# EAGLE design Control HAT v0.2A (EAGLE 9.3.1)

## Sheet 1 of 2
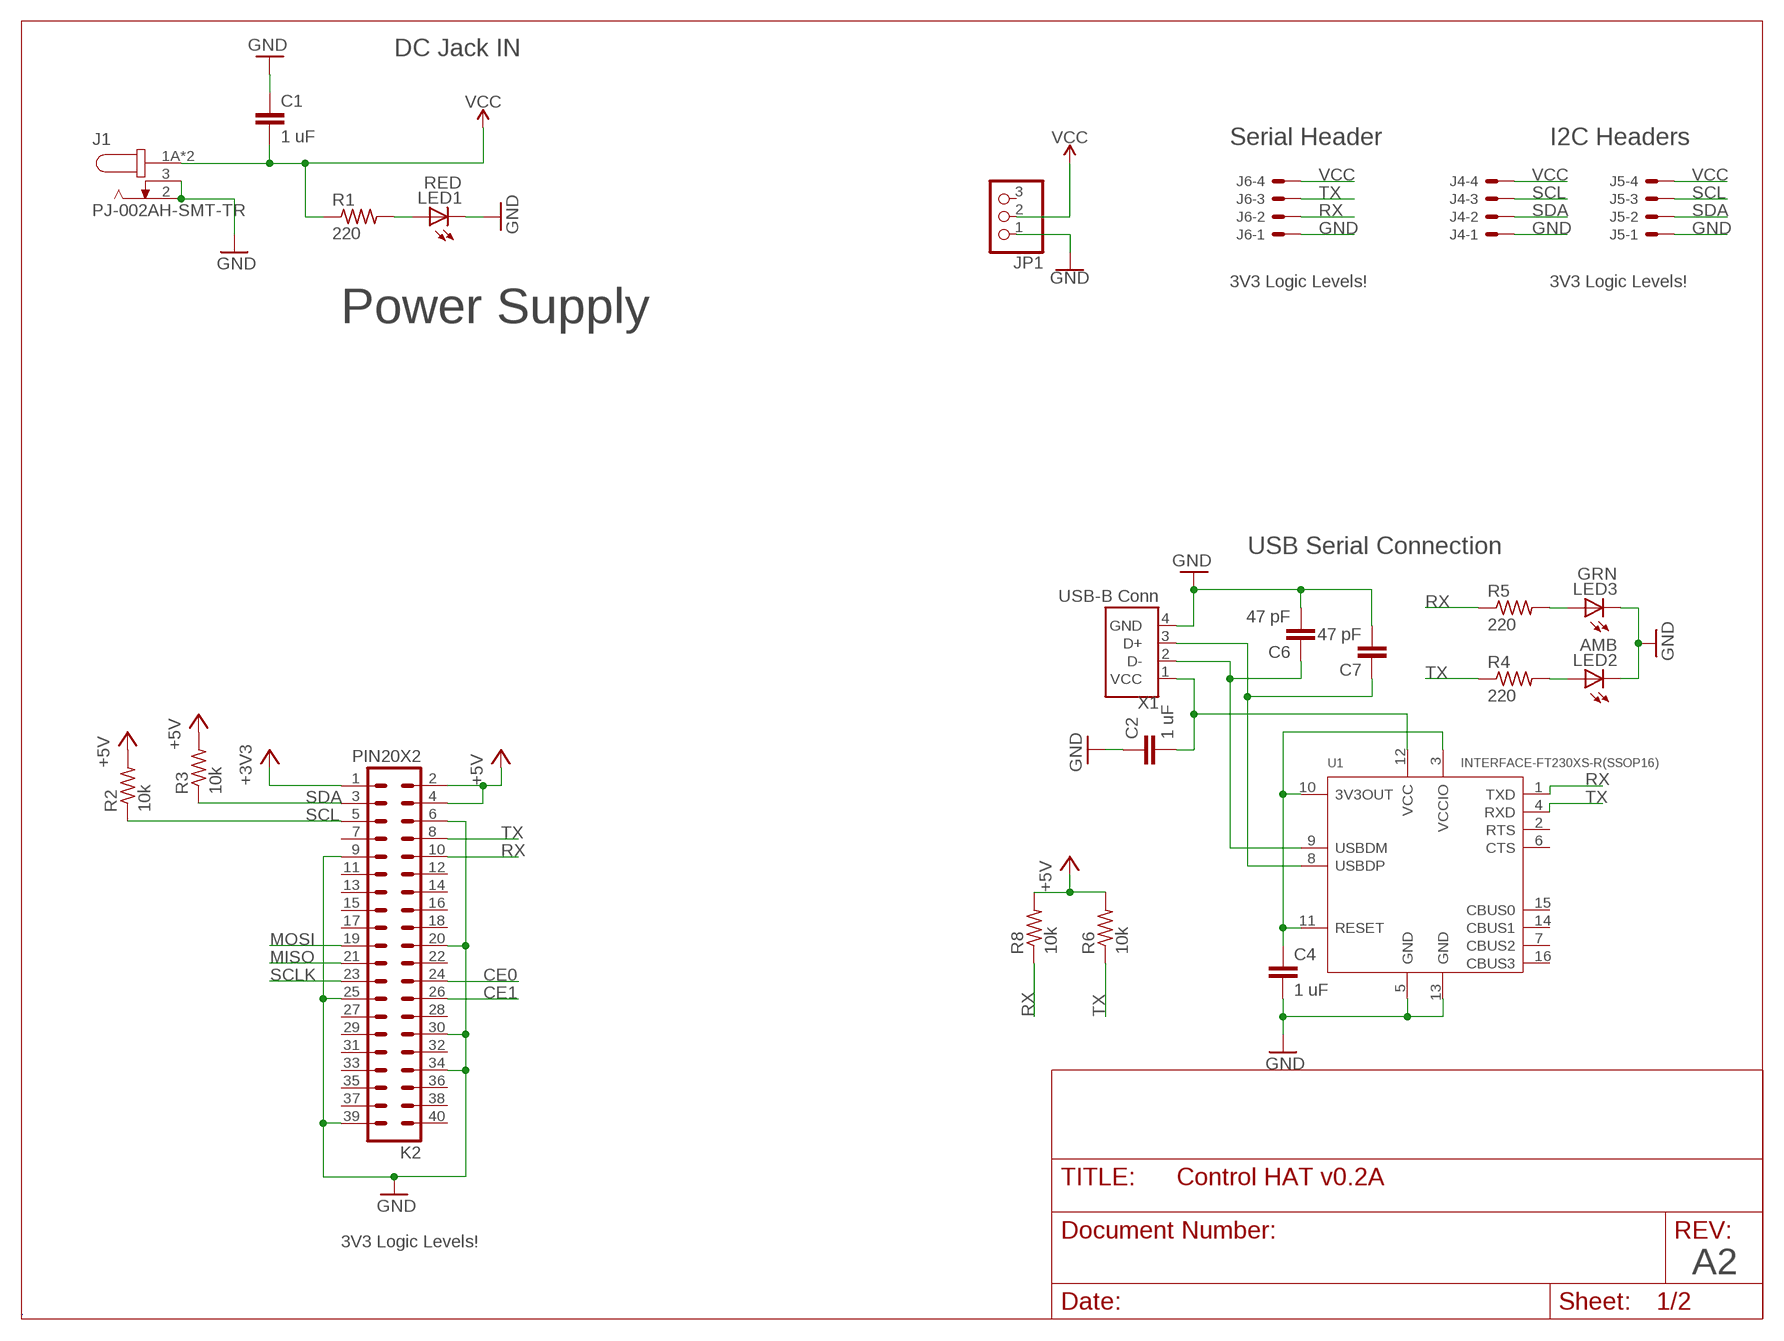
[diagram p0: schematic, sheet 1]
FRAME1 (LETTER_L): SPICEPREFIX: X

### Parts
C1  1 uF  C-EUC0603  [C0603]
C2  1 uF  C-EUC0603  [C0603]
C4  1 uF  C-EUC0603  [C0603]
C6  47 pF  C-EUC0603  [C0603]
C7  47 pF  C-EUC0603  [C0603]
J1  PJ-002AH-SMT-TR  [CUI_PJ-002AH-SMT-TR]
J4  JST-XH-04-PIN-LONG-PAD  [JST-XH-04-PACKAGE-LONG-PAD]
J5  JST-XH-04-PIN-LONG-PAD  [JST-XH-04-PACKAGE-LONG-PAD]
J6  JST-XH-04-PIN-LONG-PAD  [JST-XH-04-PACKAGE-LONG-PAD]
JP1  PINHD-1X3  [1X03]
K2  PIN20X2  [PIN_20X2]
LED1  RED  LEDCHIP-LED0603  [CHIP-LED0603]
LED2  AMB  LEDCHIP-LED0603  [CHIP-LED0603]
LED3  GRN  LEDCHIP-LED0603  [CHIP-LED0603]
R1  220  R-US_M1206  [M1206]
R2  10k  R-US_M1206  [M1206]
R3  10k  R-US_M1206  [M1206]
R4  220  R-US_M1206  [M1206]
R5  220  R-US_M1206  [M1206]
R6  10k  R-US_M1206  [M1206]
R8  10k  R-US_M1206  [M1206]
U1  INTERFACE-FT230XS-R(SSOP16)  [SSOP16-0.635-5X4MM]
X1  USB-B Conn  USB-B1HSB6  [OST_USB-B1HSB6]

### Nets
3V3OUT: C4.1 U1.3(VCCIO) U1.10(3V3OUT) U1.11(RESET)
+3V3: K2.1
+5V: K2.2 K2.4 R2.2 R3.2 R6.2 R8.2
CE0: K2.24
CE1: K2.26
GND: C1.1 C2.1 C4.2 C6.2 C7.2 J1.2 J1.3 J4.1 J5.1 J6.1 JP1.1 K2.6 K2.9 K2.20 K2.25 K2.30 K2.34 K2.39 LED1.C LED2.C LED3.C U1.5(GND) U1.13(GND) X1.4(GND) ; also sheet 2
MISO: K2.21
MOSI: K2.19
N$1: C6.1 U1.9(USBDM) X1.2(D-)
N$2: LED2.A R4.2
N$4: LED1.A R1.2
N$6: C2.2 U1.12(VCC) X1.1(VCC)
N$7: C7.1 U1.8(USBDP) X1.3(D+)
N$8: LED3.A R5.2
RX: J6.2 K2.10 R5.1 R8.1 U1.1(TXD)
SCL: J4.3 J5.3 K2.5 R2.1 ; also sheet 2
SCLK: K2.23
SDA: J4.2 J5.2 K2.3 R3.1 ; also sheet 2
TX: J6.3 K2.8 R4.1 R6.1 U1.4(RXD)
VCC: C1.2 J1.1A J1.1B J4.4 J5.4 J6.4 JP1.2 R1.1 ; also sheet 2
Unconnected: JP1.3 K2.7 K2.11 K2.12 K2.13 K2.14 K2.15 K2.16 K2.17 K2.18 K2.22 K2.27 K2.28 K2.29 K2.31 K2.32 K2.33 K2.35 K2.36 K2.37 K2.38 K2.40 U1.2(RTS) U1.6(CTS) U1.7(CBUS2) U1.14(CBUS1) U1.15(CBUS0) U1.16(CBUS3)

### Notes on the sheet
- DC Jack IN
- Serial Header | I2C Headers
- 3V3 Logic Levels! | 3V3 Logic Levels!
- Power Supply
- USB Serial Connection
- 3V3 Logic Levels!
- A2
- C:/Users/legoh/Documents/Projects/Eagle Projects/Project Argo/References/Pinky and the Brain MC.bmp
- C:/Users/legoh/Documents/Projects/Eagle Projects/Project Argo/References/Pinky and the Brain MC.bmp | C:/Users/legoh/Documents/Projects/Eagle Projects/Project Argo/References/Pinky and the Brain MC.bmp

## Sheet 2 of 2
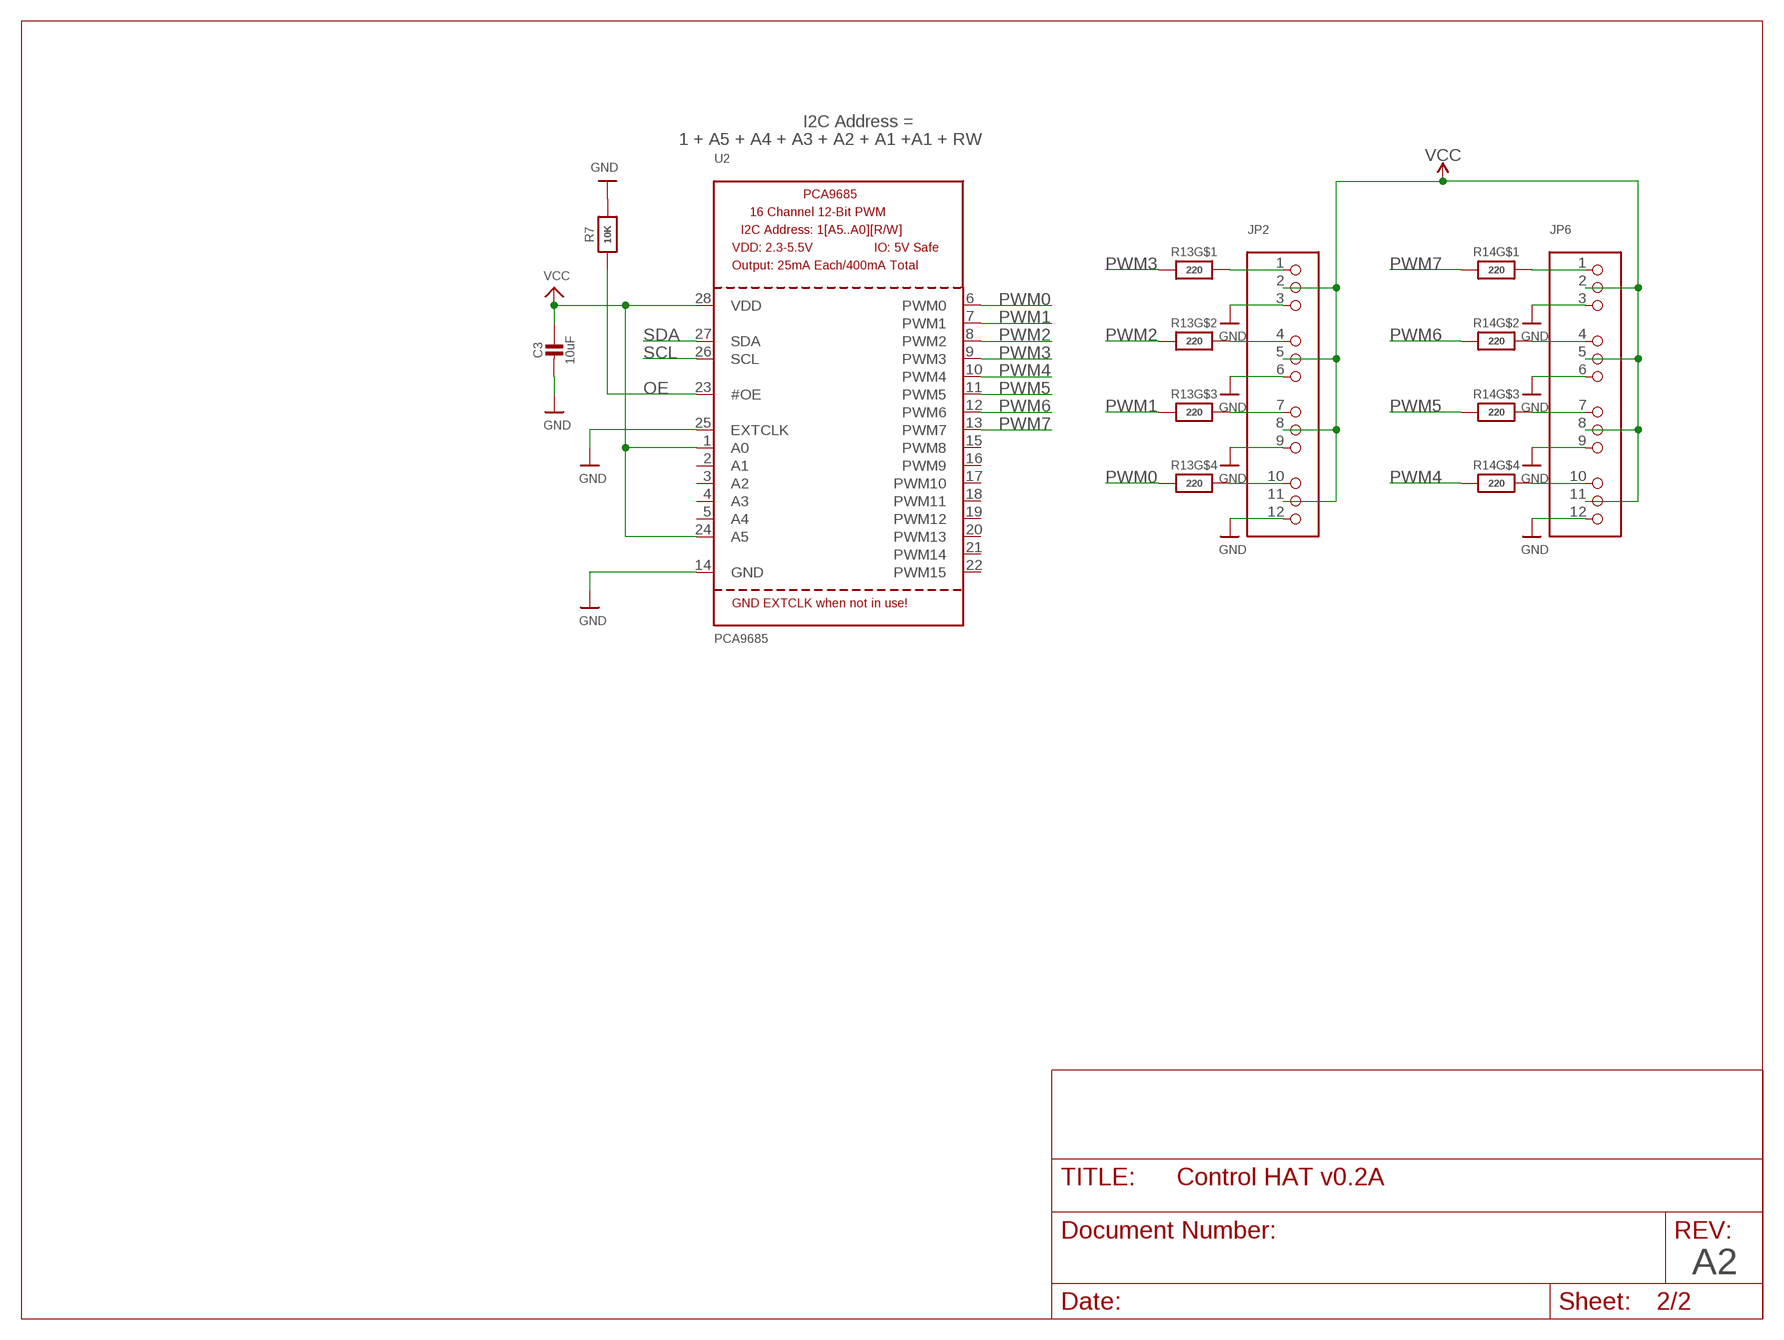
[diagram p1: schematic, sheet 2]

### Parts
C3  10uF  CAP_CERAMIC0805-NOOUTLINE  [0805-NO]
JP2  HEADER-3X04  [3X04]
JP6  HEADER-3X04  [3X04]
R7  10K  RESISTOR0805_NOOUTLINE  [0805-NO]
R13  220  RESISTOR_4PACK  [RESPACK_4X0603]
R14  220  RESISTOR_4PACK  [RESPACK_4X0603]
U2  PCA9685  [TSSOP28]

### Nets
GND: C3.2 JP2.3 JP2.6 JP2.9 JP2.12 JP6.3 JP6.6 JP6.9 JP6.12 R7.2 U2.14(GND) U2.25(EXTCLK) ; also sheet 1
N$3: JP2.1 R13.8
N$5: JP2.4 R13.7
N$9: JP2.7 R13.6
N$10: JP2.10 R13.5
N$11: JP6.10 R14.5
N$12: JP6.7 R14.6
N$13: JP6.4 R14.7
N$14: JP6.1 R14.8
OE: R7.1 U2.23(#OE)
PWM0: R13.4 U2.6(PWM0)
PWM1: R13.3 U2.7(PWM1)
PWM2: R13.2 U2.8(PWM2)
PWM3: R13.1 U2.9(PWM3)
PWM4: R14.4 U2.10(PWM4)
PWM5: R14.3 U2.11(PWM5)
PWM6: R14.2 U2.12(PWM6)
PWM7: R14.1 U2.13(PWM7)
SCL: U2.26(SCL) ; also sheet 1
SDA: U2.27(SDA) ; also sheet 1
VCC: C3.1 JP2.2 JP2.5 JP2.8 JP2.11 JP6.2 JP6.5 JP6.8 JP6.11 U2.1(A0) U2.24(A5) U2.28(VDD) ; also sheet 1
Unconnected: U2.2(A1) U2.3(A2) U2.4(A3) U2.5(A4) U2.15(PWM8) U2.16(PWM9) U2.17(PWM10) U2.18(PWM11) U2.19(PWM12) U2.20(PWM13) U2.21(PWM14) U2.22(PWM15)

### Notes on the sheet
- I2C Address =
- 1 + A5 + A4 + A3 + A2 + A1 +A1 + RW
- A2

## Library data of the parts
C1 C2 C4 C6 C7 = rcl:C-EU: CAPACITOR, European symbol; SPICEPREFIX: C
C3 = microbuilder:CAP_CERAMIC: Ceramic Capacitors For new designs, use the packages preceded by an '_' character since they are more reliable: The following footprints should be used on most boards: _0402 - Standard footprint for regular board layouts _0603 - Standard footprint for regular board layouts _0805 - Standard footprint for regular board layouts _1206 - Standard footprint for regular board layouts For extremely tight-pitch boards where space is at a premium, the following 'micro-pitch' footprints can be used (smaller pads, no silkscreen outline, etc.): _0402MP - Micro-pitch footprint for very dense/compact boards _0603MP - Micro-pitch footprint for very dense/compact boards _0805MP - Micro-pitch footprint for very dense/compact boards _1206MP - Micro-pitch footprint for very dense/compact boards
J1 = PJ-002AH-SMT-TR:PJ-002AH-SMT-TR: 2.0 mm Center Pin, 5.0 A, Right Angle, Surface Mount (SMT), Dc Power Jack Connector; CUI_PURCHASE_URL: https://www.cui.com/product/interconnect/dc-power-connectors/jacks/2.0-mm-center-pin/pj-002ah-smt-tr?utm_source=snapeda.com&utm_medium=referral&utm_campaign=snapedaBOM; DESCRIPTION: 24 VDC 5 A Surface Mount Unshielded 2 Conductors 3 Contacts Male Power Jack; DIGI-KEY_PART_NUMBER: CP-002AHPJCT-ND; DIGI-KEY_PURCHASE_URL: https://www.digikey.com/product-detail/en/cui-inc/PJ-002AH-SMT-TR/CP-002AHPJCT-ND/669692?utm_source=snapeda&utm_medium=aggregator&utm_campaign=symbol; MF: CUI Inc.; MP: PJ-002AH-SMT-TR; PACKAGE: None
J4-J6 = JST XH Connectors v1-0:JST-XH-04-PIN: JST XH Connector 2 Pin Wire to board connector. Pitch: 2,54 mm, (0.100") Number of pins: 4 Created by Rembrandt Electronics www.rembrandtelectronics.com
JP1 = pinhead:PINHD-1X3: PIN HEADER
JP2 JP6 = microbuilder:HEADER-3X04
K2 = FLYFISH:PIN20X2
LED1-LED3 = led:LED: LED OSRAM: - CHIPLED LG R971, LG N971, LY N971, LG Q971, LY Q971, LO R971, LY R971 LH N974, LH R974 LS Q976, LO Q976, LY Q976 LO Q996 - Hyper CHIPLED LW Q18S LB Q993, LB Q99A, LB R99A - SideLED LS A670, LO A670, LY A670, LG A670, LP A670 LB A673, LV A673, LT A673, LW A673 LH A674 LY A675 LS A676, LA A676, LO A676, LY A676, LW A676 LS A679, LY A679, LG A679 - Hyper Micro SIDELED® LS Y876, LA Y876, LO Y876, LY Y876 LT Y87S - SmartLED LW L88C, LW L88S LB L89C, LB L89S, LG L890 LS L89K, LO L89K, LY L89K LS L896, LA L896, LO L896, LY L896 - TOPLED LS T670, LO T670, LY T670, LG T670, LP T670 LSG T670, LSP T670, LSY T670, LOP T670, LYG T670 LG T671, LOG T671, LSG T671 LB T673, LV T673, LT T673, LW T673 LH T674 LS T676, LA T676, LO T676, LY T676, LB T676, LH T676, LSB T676, LW T676 LB T67C, LV T67C, LT T67C, LS T67K, LO T67K, LY T67K, LW E67C LS E67B, LA E67B, LO E67B, LY E67B, LB E67C, LV E67C, LT E67C LW T67C LS T679, LY T679, LG T679 LS T770, LO T770, LY T770, LG T770, LP T770 LB T773, LV T773, LT T773, LW T773 LH T774 LS E675, LA E675, LY E675, LS T675 LS T776, LA T776, LO T776, LY T776, LB T776 LHGB T686 LT T68C, LB T68C - Hyper Mini TOPLED® LB M676 - Mini TOPLED Santana® LG M470 LS M47K, LO M47K, LY M47K Source: http://www.osram.convergy.de LUXEON: - LUMILED® LXK2-PW12-R00, LXK2-PW12-S00, LXK2-PW14-U00, LXK2-PW14-V00 LXK2-PM12-R00, LXK2-PM12-S00, LXK2-PM14-U00 LXK2-PE12-Q00, LXK2-PE12-R00, LXK2-PE12-S00, LXK2-PE14-T00, LXK2-PE14-U00 LXK2-PB12-K00, LXK2-PB12-L00, LXK2-PB12-M00, LXK2-PB14-N00, LXK2-PB14-P00, LXK2-PB14-Q00 LXK2-PR12-L00, LXK2-PR12-M00, LXK2-PR14-Q00, LXK2-PR14-R00 LXK2-PD12-Q00, LXK2-PD12-R00, LXK2-PD12-S00 LXK2-PH12-R00, LXK2-PH12-S00 LXK2-PL12-P00, LXK2-PL12-Q00, LXK2-PL12-R00 Source: www.luxeon.com KINGBRIGHT: KA-3528ASYC Source: www.kingbright.com
R1-R6 R8 = resistor:R-US_: RESISTOR, American symbol
R7 = microbuilder:RESISTOR: Resistors For new designs, use the packages preceded by an '_' character since they are more reliable: The following footprints should be used on most boards: _0402 - Standard footprint for regular board layouts _0603 - Standard footprint for regular board layouts _0805 - Standard footprint for regular board layouts _1206 - Standard footprint for regular board layouts For extremely tight-pitch boards where space is at a premium, the following 'micro-pitch' footprints can be used (smaller pads, no silkscreen outline, etc.): _0402MP - Micro-pitch footprint for very dense/compact boards _0603MP - Micro-pitch footprint for very dense/compact boards _0805MP - Micro-pitch footprint for very dense/compact boards _1206MP - Micro-pitch footprint for very dense/compact boards
R13 R14 = microbuilder:RESISTOR_4PACK: Resistor Packs (4 resistors) 4 x 0603 10K 1/16W - Digikey: YC164J-10KCT-ND
U1 = FT230XS:INTERFACE-FT230XS-R(SSOP16): 310070030; AVAILABILITY: Unavailable; DESCRIPTION: USB Full Speed to Basic UART IC with USB Charger Detection; MF: FTDI,; MP: FT230XS-R; PACKAGE: SSOP-16 FTDI; PRICE: None
U2 = microbuilder:PCA9685: PCA9685 - 16 Channel 12-Bit I2C PWM Controller 5.0V tolerant 16 channel, 12-bit I2C PWM controller with 25mA per output (max. 400mA total) Digikey: 568-5931-1-ND
X1 = USB-B Connector:USB-B1HSB6: Conn Usb Type b r/a Black; AVAILABILITY: Unavailable; DESCRIPTION: Conn Usb Type b r/a Black; MF: On Shore; MP: USB-B1HSB6; PACKAGE: None; PRICE: None

## Board
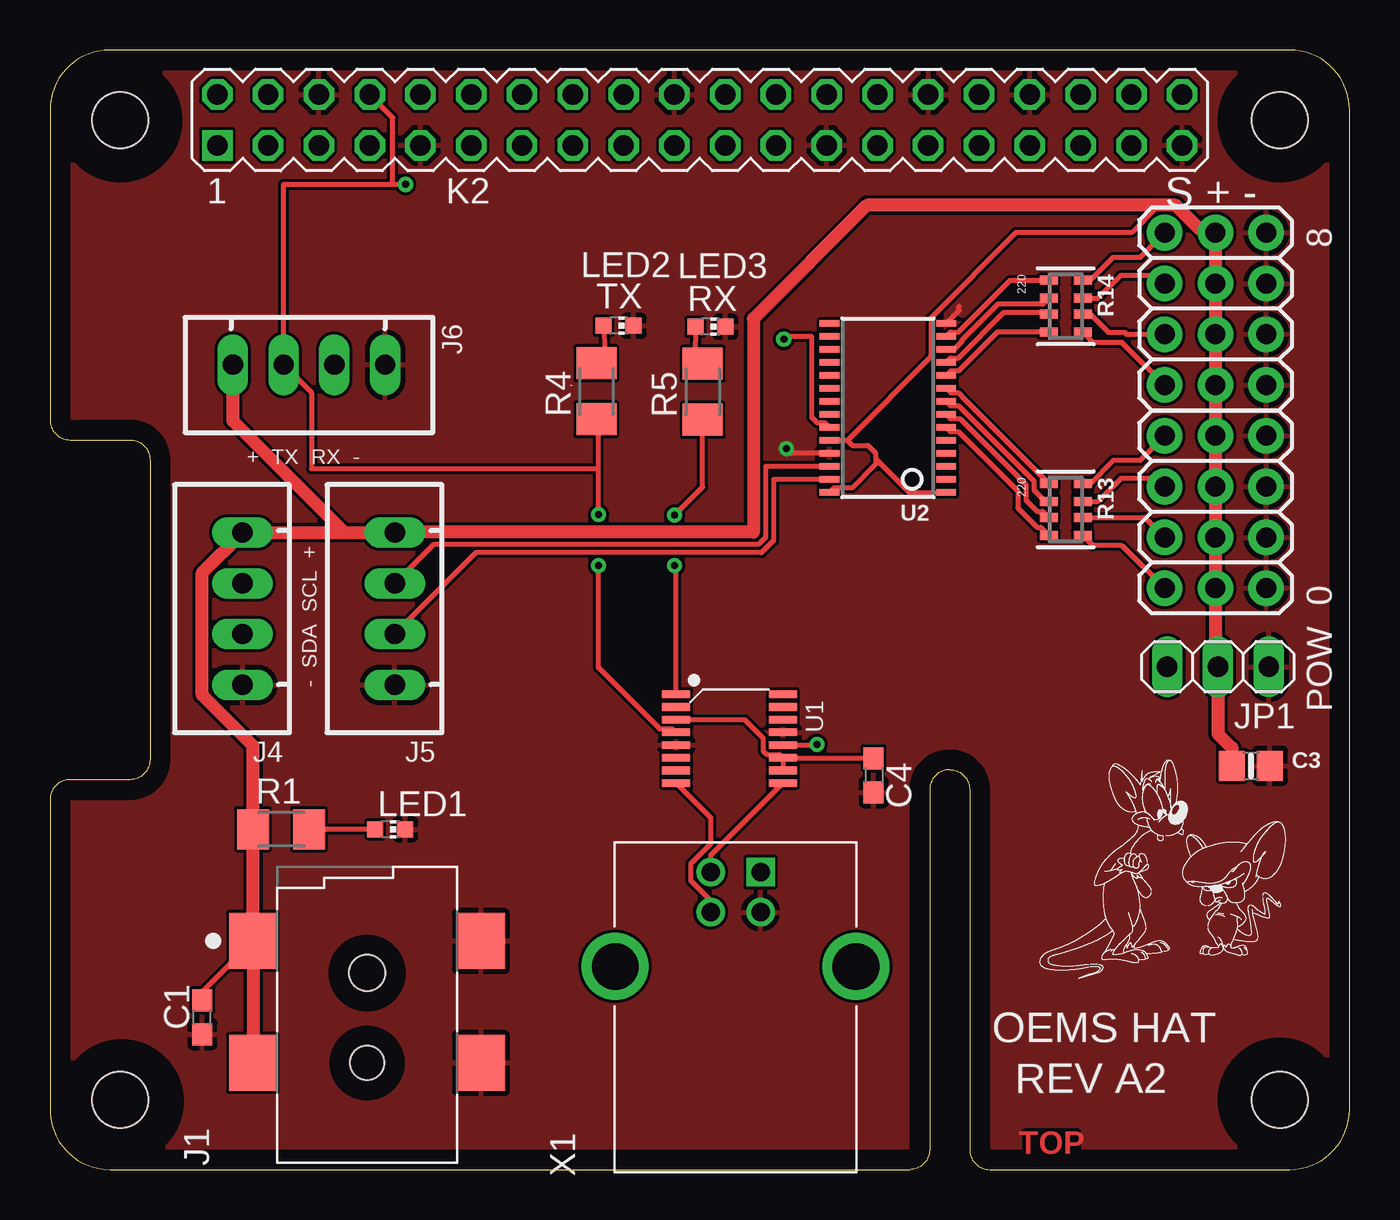
[diagram p2: board, top side]
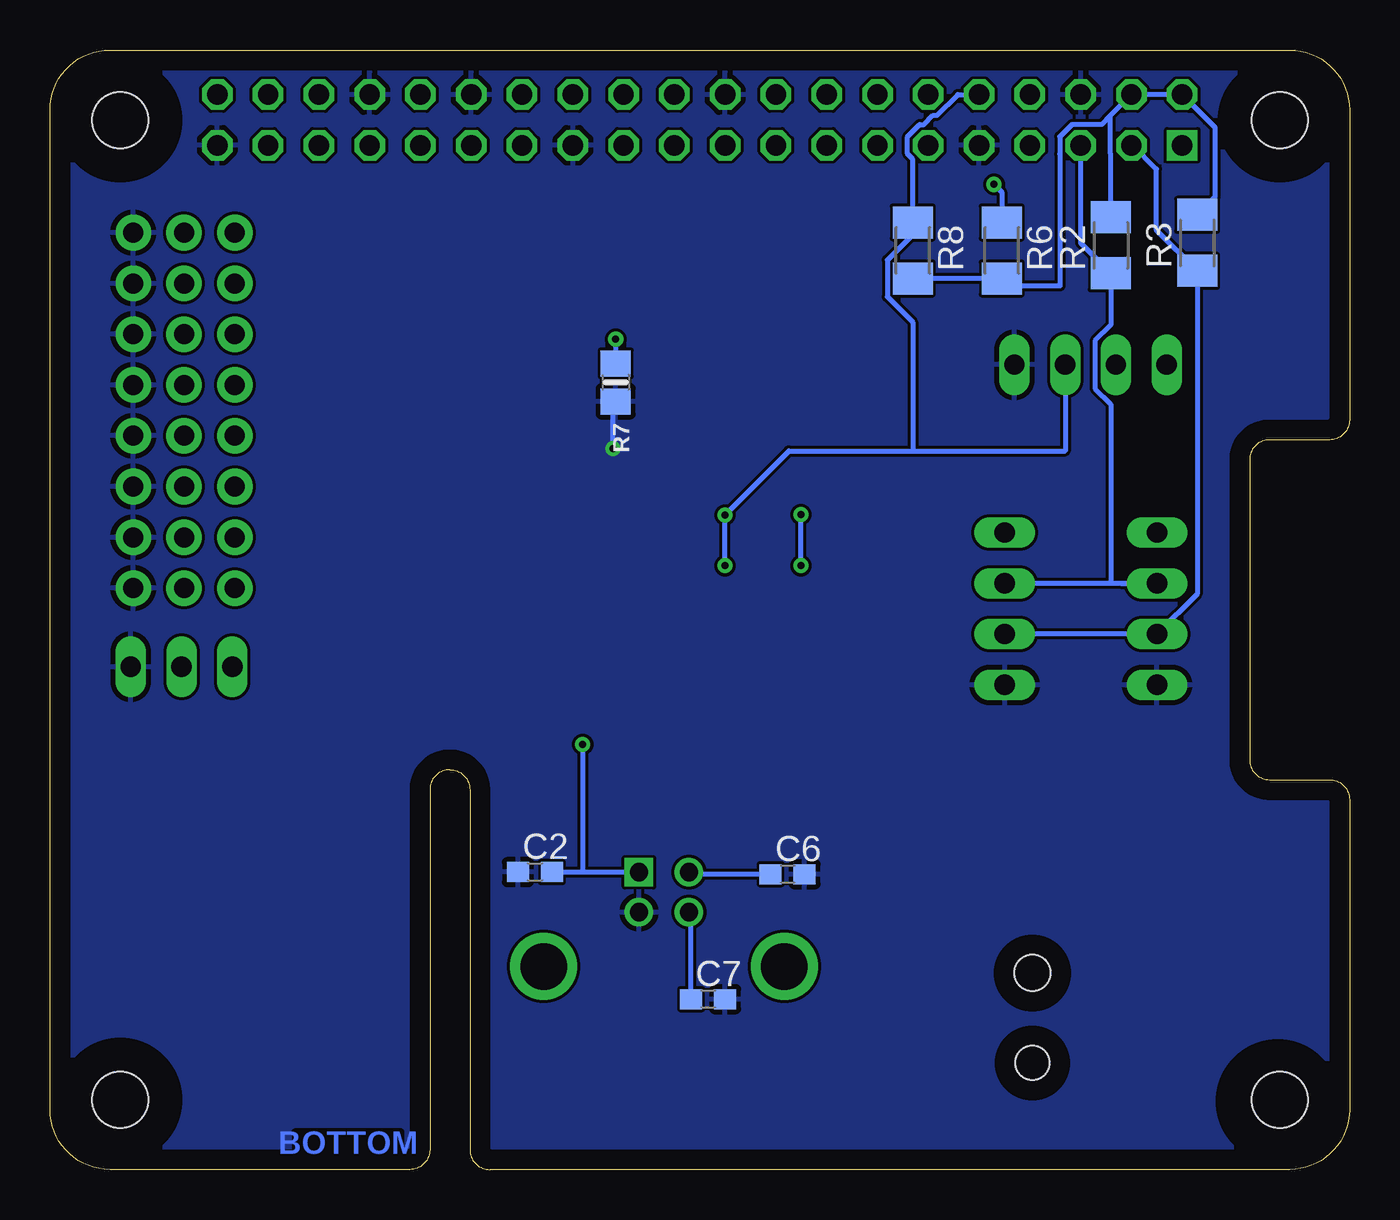
[diagram p3: board, bottom side, seen from below]

Size 65 x 56 mm. Coordinates in mm from the lower left corner, seen from the top.
Outline: 0,3 arc90 3,0 43,0 arc90 44,1 44,19 arc-90 45,20 arc-90 46,19 46,1 arc90 47,0 62,0 arc90 65,3 65,53 arc90 62,56 3,56 arc90 0,53 0,37.5 arc90 1,36.5 4,36.5 arc-90 5,35.5 5,20.5 arc-90 4,19.5 1,19.5 arc90 0,18.5 0,3
Copper layers (1*16): Top 0.035mm / dielectric 1.5mm / Bottom 0.035mm
Design rules "default": minimum track width 6mil, minimum drill 0.35mm, track to track 6mil, track to pad 6mil, pad to pad 6mil, via to via 6mil, smd to smd 6mil, copper to edge 40mil, drill to drill 6mil, minimum pad ring 10mil, minimum via ring 8mil, stop-mask expansion 4mil, vias tented up to drill 0mil, thermal gap 10mil
Holes 2.8 mm at 3.5,3.5 3.5,52.5 61.5,52.5 61.5,3.5
tRestrict: area 1.9,51 to 5,54; area 60,51 to 63,54; area 60,1.9 to 63,5; area 2,1.9 to 5.1,5
bRestrict: area 1.9,51 to 5,54; area 60,1.9 to 63,5; area 60,51 to 63,54; area 2,1.9 to 5.1,5

### Footprints (pad centres in the part's own frame; a part is rotated, then mirrored left to right if it is on the bottom)
C0603 = smd 1.1 x 1: 1 -0.85,0; 2 0.85,0
0805-NO = smd 1.3 x 1.5: 1 -0.95,0; 2 0.95,0
CUI_PJ-002AH-SMT-TR = smd 2.8 x 2.4: 1A 0,0; 1B -6.1,0; 2 -6.1,-11.4; 3 0,-11.4 | hole 1.7: -6.1,-5.7 | hole 1.8: -1.6,-5.7
JST-XH-04-PACKAGE-LONG-PAD = drill 1.016 long: 1 -3.81,0; 2 -1.27,0; 3 1.27,0; 4 3.81,0
1X03 = drill 1.016 long: 1 -2.54,0; 2 0,0; 3 2.54,0
3X04 = drill 1 pad 1.778: 1 -3.81,-2.54; 2 -3.81,0; 3 -3.81,2.54; 4 -1.27,-2.54; 5 -1.27,0; 6 -1.27,2.54; 7 1.27,-2.54; 8 1.27,0; 9 1.27,2.54; 10 3.81,-2.54; 11 3.81,0; 12 3.81,2.54
PIN_20X2 = drill 1.016 square: 1 -24.13,-1.27 | drill 1.016 octagon: 2 -24.13,1.27; 3 -21.59,-1.27; 4 -21.59,1.27; 5 -19.05,-1.27; 6 -19.05,1.27; 7 -16.51,-1.27; 8 -16.51,1.27; 9 -13.97,-1.27; 10 -13.97,1.27; 11 -11.43,-1.27; 12 -11.43,1.27; 13 -8.89,-1.27; 14 -8.89,1.27; 15 -6.35,-1.27; 16 -6.35,1.27; 17 -3.81,-1.27; 18 -3.81,1.27; 19 -1.27,-1.27; 20 -1.27,1.27; 21 1.27,-1.27; 22 1.27,1.27; 23 3.81,-1.27; 24 3.81,1.27; 25 6.35,-1.27; 26 6.35,1.27; 27 8.89,-1.27; 28 8.89,1.27; 29 11.43,-1.27; 30 11.43,1.27; 31 13.97,-1.27; 32 13.97,1.27; 33 16.51,-1.27; 34 16.51,1.27; 35 19.05,-1.27; 36 19.05,1.27; 37 21.59,-1.27; 38 21.59,1.27; 39 24.13,-1.27; 40 24.13,1.27
CHIP-LED0603 = smd 0.8 x 0.8: A 0,-0.75; C 0,0.75
M1206 = smd 1.6 x 2: 1 -1.4,0; 2 1.4,0
RESPACK_4X0603 = smd 0.45 x 0.9: 1 -1.3,-0.85; 2 -0.4,-0.85; 3 0.4,-0.85; 4 1.3,-0.85; 5 1.3,0.85; 6 0.4,0.85; 7 -0.4,0.85; 8 -1.3,0.85
SSOP16-0.635-5X4MM = smd 0.381 x 1.397: 1 -2.223,-2.667; 2 -1.587,-2.667; 3 -0.953,-2.667; 4 -0.318,-2.667; 5 0.318,-2.667; 6 0.953,-2.667; 7 1.587,-2.667; 8 2.223,-2.667; 9 2.223,2.667; 10 1.587,2.667; 11 0.953,2.667; 12 0.318,2.667; 13 -0.318,2.667; 14 -0.953,2.667; 15 -1.587,2.667; 16 -2.223,2.667
TSSOP28 = smd 0.305 x 0.991: 1 -4.225,-2.918; 2 -3.575,-2.918; 3 -2.925,-2.918; 4 -2.275,-2.918; 5 -1.625,-2.918; 6 -0.975,-2.918; 7 -0.325,-2.918; 8 0.325,-2.918; 9 0.975,-2.918; 10 1.625,-2.918; 11 2.275,-2.918; 12 2.925,-2.918; 13 3.575,-2.918; 14 4.225,-2.918; 15 4.225,2.918; 16 3.575,2.918; 17 2.925,2.918; 18 2.275,2.918; 19 1.625,2.918; 20 0.975,2.918; 21 0.325,2.918; 22 -0.325,2.918; 23 -0.975,2.918; 24 -1.625,2.918; 25 -2.275,2.918; 26 -2.925,2.918; 27 -3.575,2.918; 28 -4.225,2.918
OST_USB-B1HSB6 = drill 0.92 square: 1 1.25,4.71 | drill 0.92: 2 -1.25,4.71; 3 -1.25,2.71; 4 1.25,2.71 | drill 2.33: P1 -6.02,0; P2 6.02,0

### Placement (x,y rotation side)
C1  7.62,7.62 90 top
C2  40.74,14.88 0 bottom
C3  60.07,20.19 0 top
C4  41.2,19.72 270 top
C6  28.11,14.77 0 bottom
C7  32.08,8.52 0 bottom
J1  10.16,11.43 90 top
J4  9.63,28.05 90 top
J5  17.25,28.05 90 top
J6  12.95,40.26 180 top
JP1  58.42,25.15 180 top
JP2  58.29,32.89 270 top
JP6  58.29,43.05 270 top
K2  32.5,52.5 0 top
LED1  17.02,17.02 270 top
LED2  28.45,42.2 270 top
LED3  33.03,42.15 270 top
R1  11.56,17.02 0 top
R2  11.94,46.23 90 bottom
R3  7.62,46.35 90 bottom
R4  27.33,38.93 90 top
R5  32.64,38.9 90 top
R6  17.4,45.97 270 bottom
R7  36.7,39.37 270 bottom
R8  21.84,45.97 270 bottom
R13  50.8,33.02 270 top
R14  50.8,43.18 270 top
U1  33.99,21.55 270 top
U2  41.91,38.1 90 top
X1  34.29,10.16 0 top

### Tracks (layer width: path | path; a pad name or v marks a point on that pad's centre or on a via)
3V3OUT
  Top 0.254: U1.11 U1.10 | U1.11 41.17,20.6 C4.1 | U1.3 34.75,22.5 35.67,21.58 35.67,20.93 35.84,20.77 36.49,20.77 U1.11
+5V
  Bottom 0.254: 12.06,47.5 R2.2 | R3.2 6.73,48.65 6.73,52.13 K2.2 K2.4 11.95,52.73 | 11.81,47.76 R2.2 | R2.2 11.94,50.79 11.95,50.8 11.95,52.73 | 11.95,52.73 12.41,52.27 13.88,52.27 14.49,51.66 14.49,50.8 14.48,50.79 14.48,44.2 17.02,44.2 R6.2 R8.2
GND  (via drill 0.35)
  Top 0.254: U2.14 45.47,42.96 45.47,43.18 | U2.25 37.07,35.83 v36.83,36.07
  Bottom 0.254: v36.83,36.07 36.83,38.29 R7.2
  pour Bottom: 0,3 arc90 3,0 43,0 arc90 44,1 44,19 arc-90 45,20 arc-90 46,19 46,1 arc90 47,0 62,0 arc90 65,3 65,53 arc90 62,56 3,56 arc90 0,53 0,37.5 arc90 1,36.5 4,36.5 arc-90 5,35.5 5,20.5 arc-90 4,19.5 1,19.5 arc90 0,18.5
  pour Top: 0,3 arc90 3,0 43,0 arc90 44,1 44,19 arc-90 45,20 arc-90 46,19 46,1 arc90 47,0 62,0 arc90 64.75,2.75 64.75,53.25 arc90 62,56 3,56 arc90 0,53 0,37.5 arc90 1,36.5 4,36.5 arc-90 5,35.5 5,20.5 arc-90 4,19.5 1,19.5 arc90 0,18.5
N$1
  Top 0.254: U1.9 33.04,15.72 X1.2
  Bottom 0.254: C6.1 32.94,14.77 X1.2
N$2
  Top 0.254: LED2.A 27.76,40.83 R4.2
N$3
  Top 0.254: R13.8 52.03,34.32 53.17,35.46 54.51,35.46 JP2.1
N$4
  Top 0.254: LED1.A R1.2
N$5
  Top 0.254: R13.7 52.41,33.42 53.55,34.56 55.35,34.56 JP2.4
N$6  (via drill 0.35)
  Top 0.254: U1.12 38.33,21.23 v38.35,21.26
  Bottom 0.254: X1.1 38.35,14.87 | 38.35,14.87 39.88,14.87 C2.2 | v38.35,21.26 38.35,14.87
N$7
  Top 0.254: U1.8 33.04,17.61 33.04,16.29 32.05,15.3 32.05,14.46 33.04,13.46 X1.3
  Bottom 0.254: C7.1 32.93,12.76 X1.3
N$8
  Top 0.254: LED3.A 32.26,40.67 R5.2
N$9
  Top 0.254: R13.6 54.76,32.62 JP2.7
N$10
  Top 0.254: R13.5 52.16,31.21 53.62,31.21 JP2.10
N$11
  Top 0.254: R14.5 52.16,41.37 53.62,41.37 JP6.10
N$12
  Top 0.254: R14.6 52.03,42.78 52.94,41.88 53.74,41.88 53.83,41.78 JP6.7
N$13
  Top 0.254: R14.7 52.41,43.58 53.55,44.72 55.35,44.72 JP6.4
N$14
  Top 0.254: R14.8 52.03,44.48 53.17,45.62 54.51,45.62 JP6.1
OE  (via drill 0.35)
  Top 0.254: U2.23 38.77,37.34 38.38,37.34 38.1,37.62 38.1,41.66 36.83,41.66 v36.7,41.53
  Bottom 0.254: v36.7,41.53 R7.1
PWM0
  Top 0.254: U2.6 45.05,36.91 45.44,36.91 48.41,33.94 48.41,33.09 49.38,32.12 49.55,32.12 R13.4
PWM1
  Top 0.254: U2.7 45.05,37.56 45.51,37.56 48.81,34.26 48.81,33.49 49.38,32.92 49.65,32.92 R13.3
PWM2
  Top 0.254: U2.8 45.05,38.21 45.44,38.21 49.22,34.42 49.22,33.98 49.78,33.42 R13.2
PWM3
  Top 0.254: U2.9 45.05,38.86 45.44,38.86 45.6,38.69 45.6,38.67 R13.1
PWM4
  Top 0.254: U2.10 45.05,39.94 45.44,39.94 47.38,41.88 R14.4
PWM5
  Top 0.254: U2.11 45.05,40.59 45.44,40.59 47.72,42.88 49.85,42.88 R14.3
PWM6
  Top 0.254: R14.2 49.65,43.28 47.41,43.28 45.6,41.48 45.6,41.41 45.22,41.02 U2.12
PWM7
  Top 0.254: U2.13 45.05,41.89 45.44,41.89 48.03,44.48 R14.1
RX  (via drill 0.35)
  Top 0.254: U1.1 31.32,30.13 v31.24,30.2 | v31.24,32.74 32.64,34.13 R5.1
  Bottom 0.254: K2.10 19.6,53.77 20.64,52.73 20.83,52.73 21.29,52.27 21.5,52.27 22.11,51.66 22.11,50.8 21.84,50.53 R8.1 21.84,46.77 23.12,45.49 23.12,43.66 21.84,42.38 21.84,35.94 | v31.24,30.2 v31.24,32.74 28.04,35.94 21.84,35.94 | 21.84,35.94 14.22,35.94 J6.2
SCL
  Top 0.254: U2.26 35.79,35.17 35.79,31.62 35.43,31.27 19.19,31.27 J5.3
  Bottom 0.254: 11.94,29.32 J4.3 11.43,29.32 | 11.94,29.32 J5.3 | R2.1 11.43,44.83 | R2.1 13.45,46.34 K2.5 | R2.1 11.94,42.24 12.72,41.45 12.72,39.07 11.94,38.28 11.94,29.32
SDA
  Top 0.254: U2.27 36.2,34.52 36.2,31.46 35.6,30.86 21.32,30.86 J5.2
  Bottom 0.254: J5.2 J4.2 7.62,28.79 R3.1 9.65,46.99 9.65,50.04 10.85,51.23 K2.3
TX  (via drill 0.35)
  Top 0.254: 17.14,49.28 17.14,52.62 K2.8 | U1.4 31.15,22.04 30.5,22.04 27.43,25.11 v27.43,30.2 | v27.43,32.77 27.43,34.92 | 27.43,34.92 27.43,37.42 R4.1 | 27.43,34.92 27.3,35.05 13.08,35.05 13.08,38.86 J6.3 11.68,49.28 17.14,49.28 | 17.14,49.28 v17.78,49.28
  Bottom 0.254: v27.43,30.2 v27.43,32.77 | v17.78,49.28 17.4,48.9 R6.1
VCC
  Top 0.254: JP6.2 57.41,46.86 56.24,48.03 55.27,48.03 54.1,46.86 48.32,46.86 44.05,42.59 44.05,40.76 44.11,40.7 39.88,36.48 | 39.88,36.48 U2.24 | 41.3,35.56 41.3,35.83 40.91,36.22 40.14,36.22 39.88,36.48 | 41.3,35.56 41.3,35.29 40.1,34.09 39.21,34.09 U2.28 | 41.3,35.56 42.98,33.88 U2.1 | J1.1A 7.62,8.89 C1.2
  Top 0.66: J1.1B J1.1A 10.16,14.61 R1.1 10.16,21.19 7.62,23.73 7.62,29.84 9.63,31.85 J4.4 14.73,31.86 | 14.73,31.86 J5.4 17.26,31.88 35.18,31.88 35.18,42.55 40.87,48.23 56.32,48.23 57.69,46.86 JP6.2 JP6.5 JP6.8 JP6.11 JP2.2 JP2.5 JP2.8 JP2.11 58.29,25.27 JP1.2 58.42,21.8 59.12,21.1 C3.1 | J6.4 9.14,37.45 14.73,31.86

### Text on the board
Top: TOP
Bottom: BOTTOM
tSilk: S + - | + TX RX - | - SDA SCL + | OEMS HAT | REV A2
_tsilk: 8 | TX | RX | 0 | POW